# Altium schematic sheet thermi_mount.SchDoc
size A4; SheetNumber: 2; SheetTotal: 2
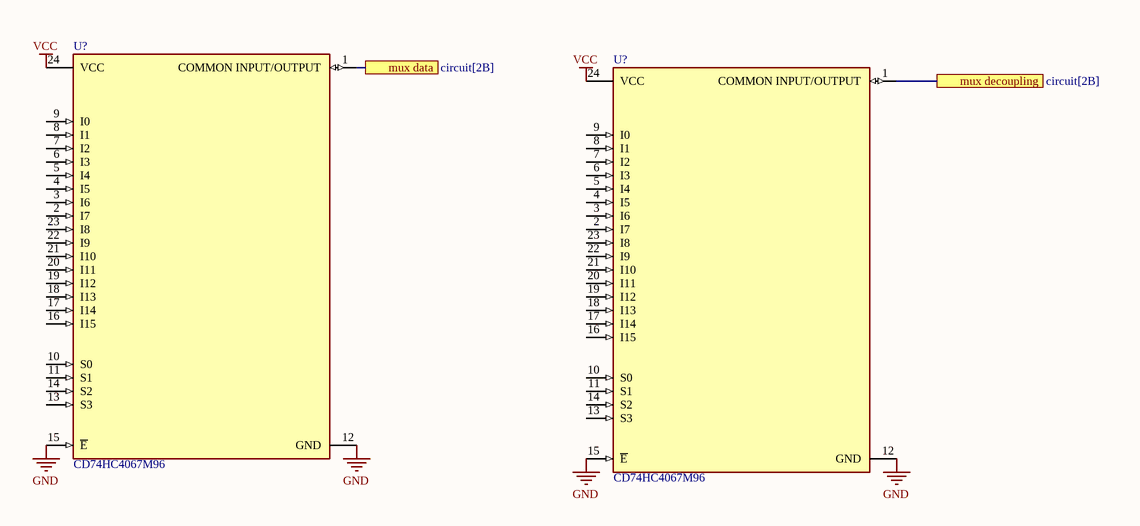
[diagram p0: thermi_mount.SchDoc]

## Parts
(Parts that share a designator on the sheet are numbered #1, #2 ... from top to bottom, then left to right.)
U?#1  CD74HC4067M96  [FP-DW0024A-MFG]
U?#2  CD74HC4067M96  [FP-DW0024A-MFG]

## Ports
mux data (see circuit[2B]), mux decoupling (see circuit[2B])

## Nets
GND: U?#1.12(GND) U?#1.15(~{E}) U?#2.12(GND) U?#2.15(~{E})
VCC: U?#1.24(VCC) U?#2.24(VCC)
mux data: U?#1.1(COMMON_INPUT/OUTPUT) ; port mux data
mux decoupling: U?#2.1(COMMON_INPUT/OUTPUT) ; port mux decoupling

Not connected (* = marked no-connect by the designer): U?#1 2(I7) 3(I6) 4(I5) 5(I4) 6(I3) 7(I2) 8(I1) 9(I0) 10(S0) 11(S1) 13(S3) 14(S2) 16(I15) 17(I14) 18(I13) 19(I12) 20(I11) 21(I10) 22(I9) 23(I8); U?#2 2(I7) 3(I6) 4(I5) 5(I4) 6(I3) 7(I2) 8(I1) 9(I0) 10(S0) 11(S1) 13(S3) 14(S2) 16(I15) 17(I14) 18(I13) 19(I12) 20(I11) 21(I10) 22(I9) 23(I8)

## Library data of the parts
U?#1 U?#2 = CMP-04901-000007-1: IC MUX/DEMUX 1X16 24SOIC; Manufacturer: Texas Instruments; Description: High-speed CMOS 16-channel analog multiplexer/demultiplexer 24-SOIC -55 to 125; Standoff Height: 0.1mm; Logic Function Desc: Non-Inverting; Max Supply Voltage: 6V; Number Of Inputs: 16; Quiescent Current: 8uA; Number Of Circuits: 1; Propagation Delay: 6ns; Max Junction Temp: +150°C; Min Supply Voltage: 2V; ComponentLink2Description: Datasheet; Octopart: https://octopart.com/cd74hc4067m96-texas+instruments-722802; Ambient Temperature Range High: +125°C; Ipc Land Pattern Name: SOIC127P1030X265-24; Height: 2.65mm; Mouser Description: Multiplexer Switch ICs Hi-Spd CMOS 16Ch Anl Mltplxr/Demltplxr; Temperature Range Low: -55°C; Package: DW0024A; Temperature Range High: +125°C; Lead Free: Yes; ComponentLink2URL: http://www.ti.com/lit/ds/symlink/cd74hc4067.pdf; Manufacturer Part Number: CD74HC4067M96; RoHS: TRUE; Automotive: No; Device Class L1: Integrated Circuits (ICs); Digikey Description: IC MUX/DEMUX 1X16 24SOIC; Device Class L2: Logic ICs; Temperature: -55°C to +125°C; Device Class L3: Multiplexers; Category: IC; Ambient Temperature Range Low: -55°C; Number Of Outputs: 1